# Altium schematic sheet czujnik_tetna.SchDoc: Czujnik tętna
size A4; DrawnBy: Grzegorz Świstak; SheetNumber: 1
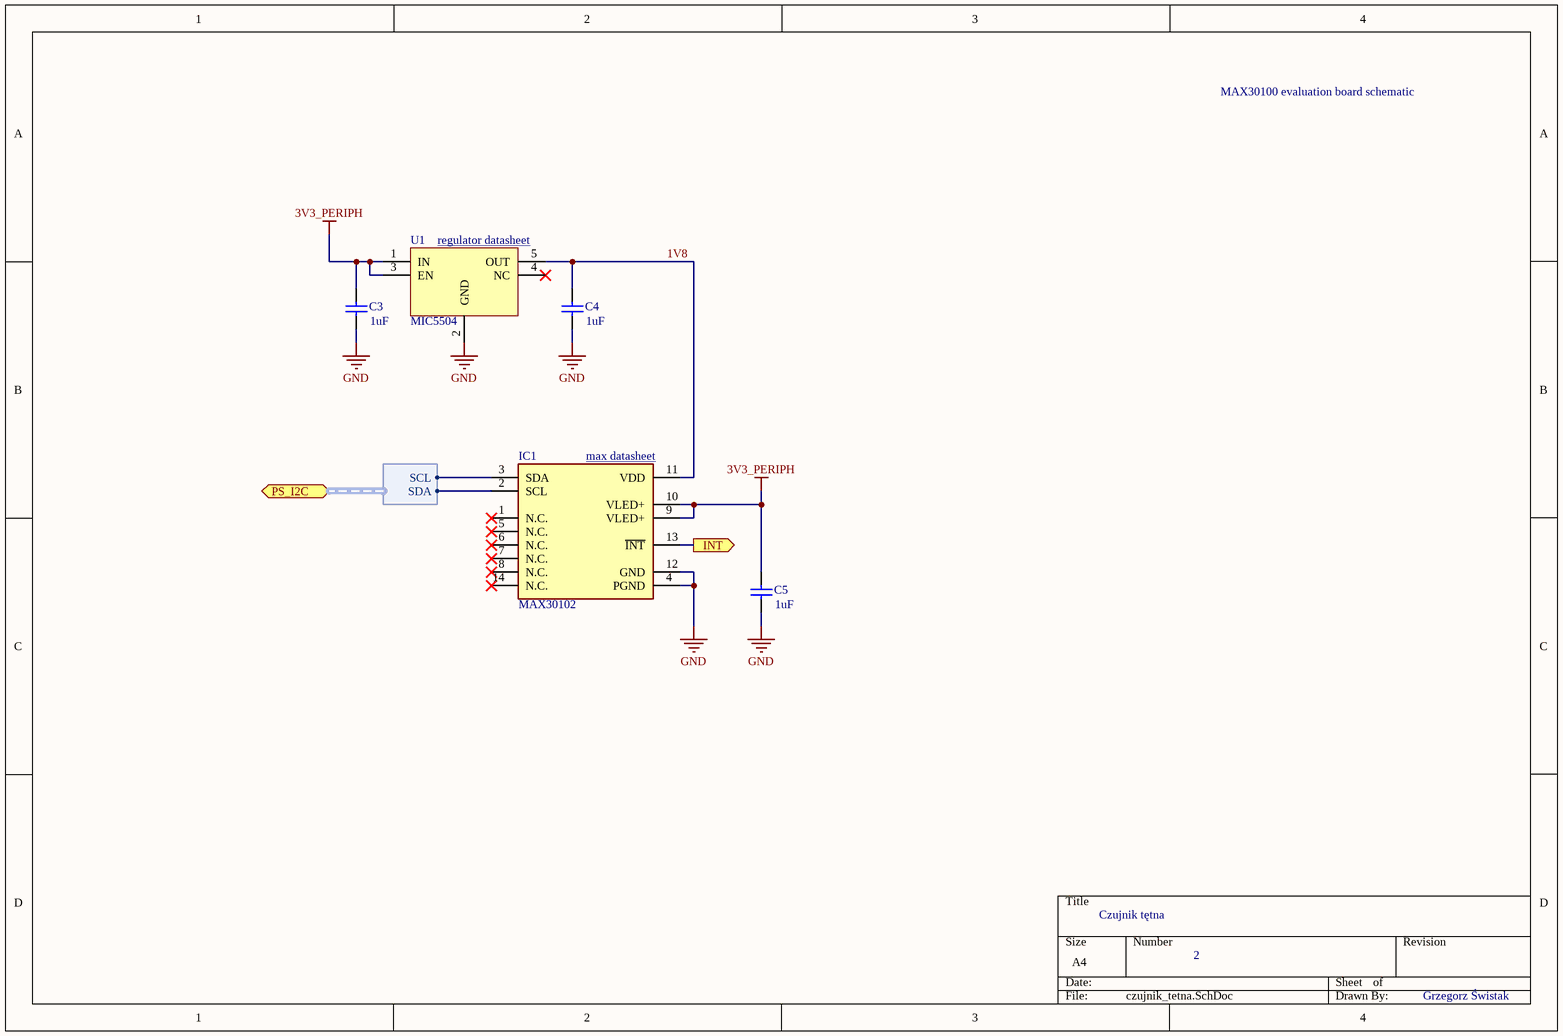
[diagram p0: czujnik_tetna.SchDoc]

## Parts
C3  value 1uF  [cap-0603]  (hidden comment: Cap)
C4  value 1uF  [cap-0603]  (hidden comment: Cap)
C5  value 1uF  [cap-0603]  (hidden comment: Cap)
IC1  MAX30102  [MAX30102EFDT]
U1  MIC5504  [SOT23-5]

## Ports
INT (out), PS_I2C (harness I2C)

## Harnesses
I2C: SDA, SCL

## Nets
3V3_PERIPH: C3.2 C5.2 IC1.9(VLED+) IC1.10(VLED+) U1.1(IN) U1.3(EN)
GND: C3.1 C4.1 C5.1 IC1.4(PGND) IC1.12(GND) U1.2(GND)
1V8: C4.2 IC1.11(VDD) U1.5(OUT)
INT: IC1.13(~{INT}) ; port INT
NetIC1_2: IC1.2(SCL) ; port PS_I2C.SDA
NetIC1_3: IC1.3(SDA) ; port PS_I2C.SCL

Not connected (* = marked no-connect by the designer): IC1 1(N.C.)* 5(N.C.)* 6(N.C.)* 7(N.C.)* 8(N.C.)* 14(N.C.)*; U1 4(NC)*

## Notes on the sheet
- MAX30100 evaluation board schematic
- (near U1) regulator datasheet <http://ww1.microchip.com/downloads/en/DeviceDoc/MIC5501-02-03-04-300mA-Single-Output-LDO-in-Small-Packages-DS20006006B.pdf>
- (near IC1) max datasheet <https://datasheets.maximintegrated.com/en/ds/MAX30102.pdf>
- 2

## Library data of the parts
C3-C5 = Cap: Capacitor; Published: 8-Jun-2000; LatestRevisionDate: 17-Jul-2002; LatestRevisionNote: Re-released for DXP Platform.; PackageReference: RAD-0.3; Publisher: Altium Limited; PackageDescription: Radial Cap, Thru-Hole; 2 Leads; 0.3 in Pin Spacing
IC1 = MAX30102EFD+T: https://datasheets.maximintegrated.com/en/ds/MAX30102.pdf; Datasheet Link: https://datasheets.maximintegrated.com/en/ds/MAX30102.pdf; Height: 1.65mm; Manufacturer_Name: Maxim Integrated; Manufacturer_Part_Number: MAX30102EFD+T; Arrow Part Number: MAX30102EFD+T; Mouser Part Number: 700-MAX30102EFD+T; Mouser Price/Stock: https://www.mouser.co.uk/ProductDetail/Maxim-Integrated/MAX30102EFD%2bT?qs=nVS1qgv%252BQrkHA4%2FoFYriFA%3D%3D
U1 = MIC5504: http://ww1.microchip.com/downloads/en/DeviceDoc/21813F.pdf